# EAGLE design Tempy (EAGLE 7.1.0)
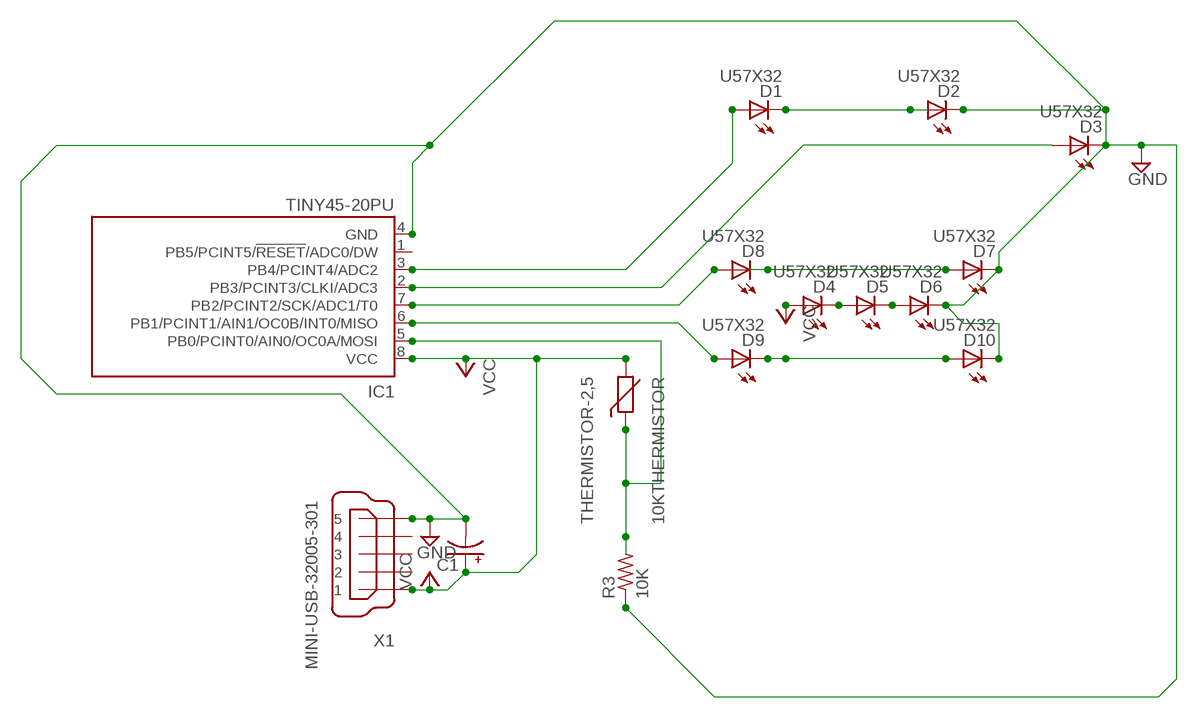
[diagram p0: schematic, sheet 1]

## Parts
10KTHERMISTOR  THERMISTOR-2,5  [RS-2,5]
C1  CPOL-USE5-4  [E5-4]
D1  U57X32  [U57X32]
D2  U57X32  [U57X32]
D3  U57X32  [U57X32]
D4  U57X32  [U57X32]
D5  U57X32  [U57X32]
D6  U57X32  [U57X32]
D7  U57X32  [U57X32]
D8  U57X32  [U57X32]
D9  U57X32  [U57X32]
D10  U57X32  [U57X32]
IC1  TINY45-20PU  TINY13-20PU  [DIL08]
R3  10K  R-US_0204/7  [0204/7]
X1  MINI-USB-32005-301  [32005-301]

## Nets
GND: C1.- D2.K(C) D3.K(C) D6.K(C) D7.K(C) D10.K(C) IC1.4(GND) R3.1 X1.5
N$1: D4.K(C) D5.A
N$2: D5.K(C) D6.A
N$3: D9.A IC1.6(PB1/PCINT1/AIN1/OC0B/INT0/MISO)
N$4: D1.K(C) D2.A
N$5: D8.A IC1.7(PB2/PCINT2/SCK/ADC1/T0)
N$6: D7.A D8.K(C)
N$7: D9.K(C) D10.A
N$8: D3.A IC1.2(PB3/PCINT3/CLKI/ADC3)
N$9: D1.A IC1.3(PB4/PCINT4/ADC2)
N$11: 10KTHERMISTOR.1 IC1.5(PB0/PCINT0/AIN0/OC0A/MOSI) R3.2
VCC: 10KTHERMISTOR.2 C1.+ D4.A IC1.8(VCC) X1.1
Unconnected: IC1.1(PB5/PCINT5/!RESET!/ADC0/DW) X1.2 X1.3 X1.4

## Library data of the parts
10KTHERMISTOR = varistor:THERMISTOR: THERMISTOR
C1 = rcl:CPOL-US: POLARIZED CAPACITOR, American symbol
D1-D10 = led:U57X32: LED rectangle, 5.7 x 3.2 mm
IC1 = atmel:TINY13: 8-bit AVR Microcontroller with 1K Bytes In-System Programmable Flash Source: http://www.atmel.com/dyn/resources/prod_documents/2535S.pdf; MPN: ATTINY13-20PU; OC_FARNELL: 9171550; OC_NEWARK: 96K6521
R3 = rcl:R-US_: RESISTOR, American symbol
X1 = con-cypressindustries:MINI-USB-: MINI USB-B Conector Source: www.cypressindustries.com; OC_FARNELL: unknown; OC_NEWARK: unknown

## Board
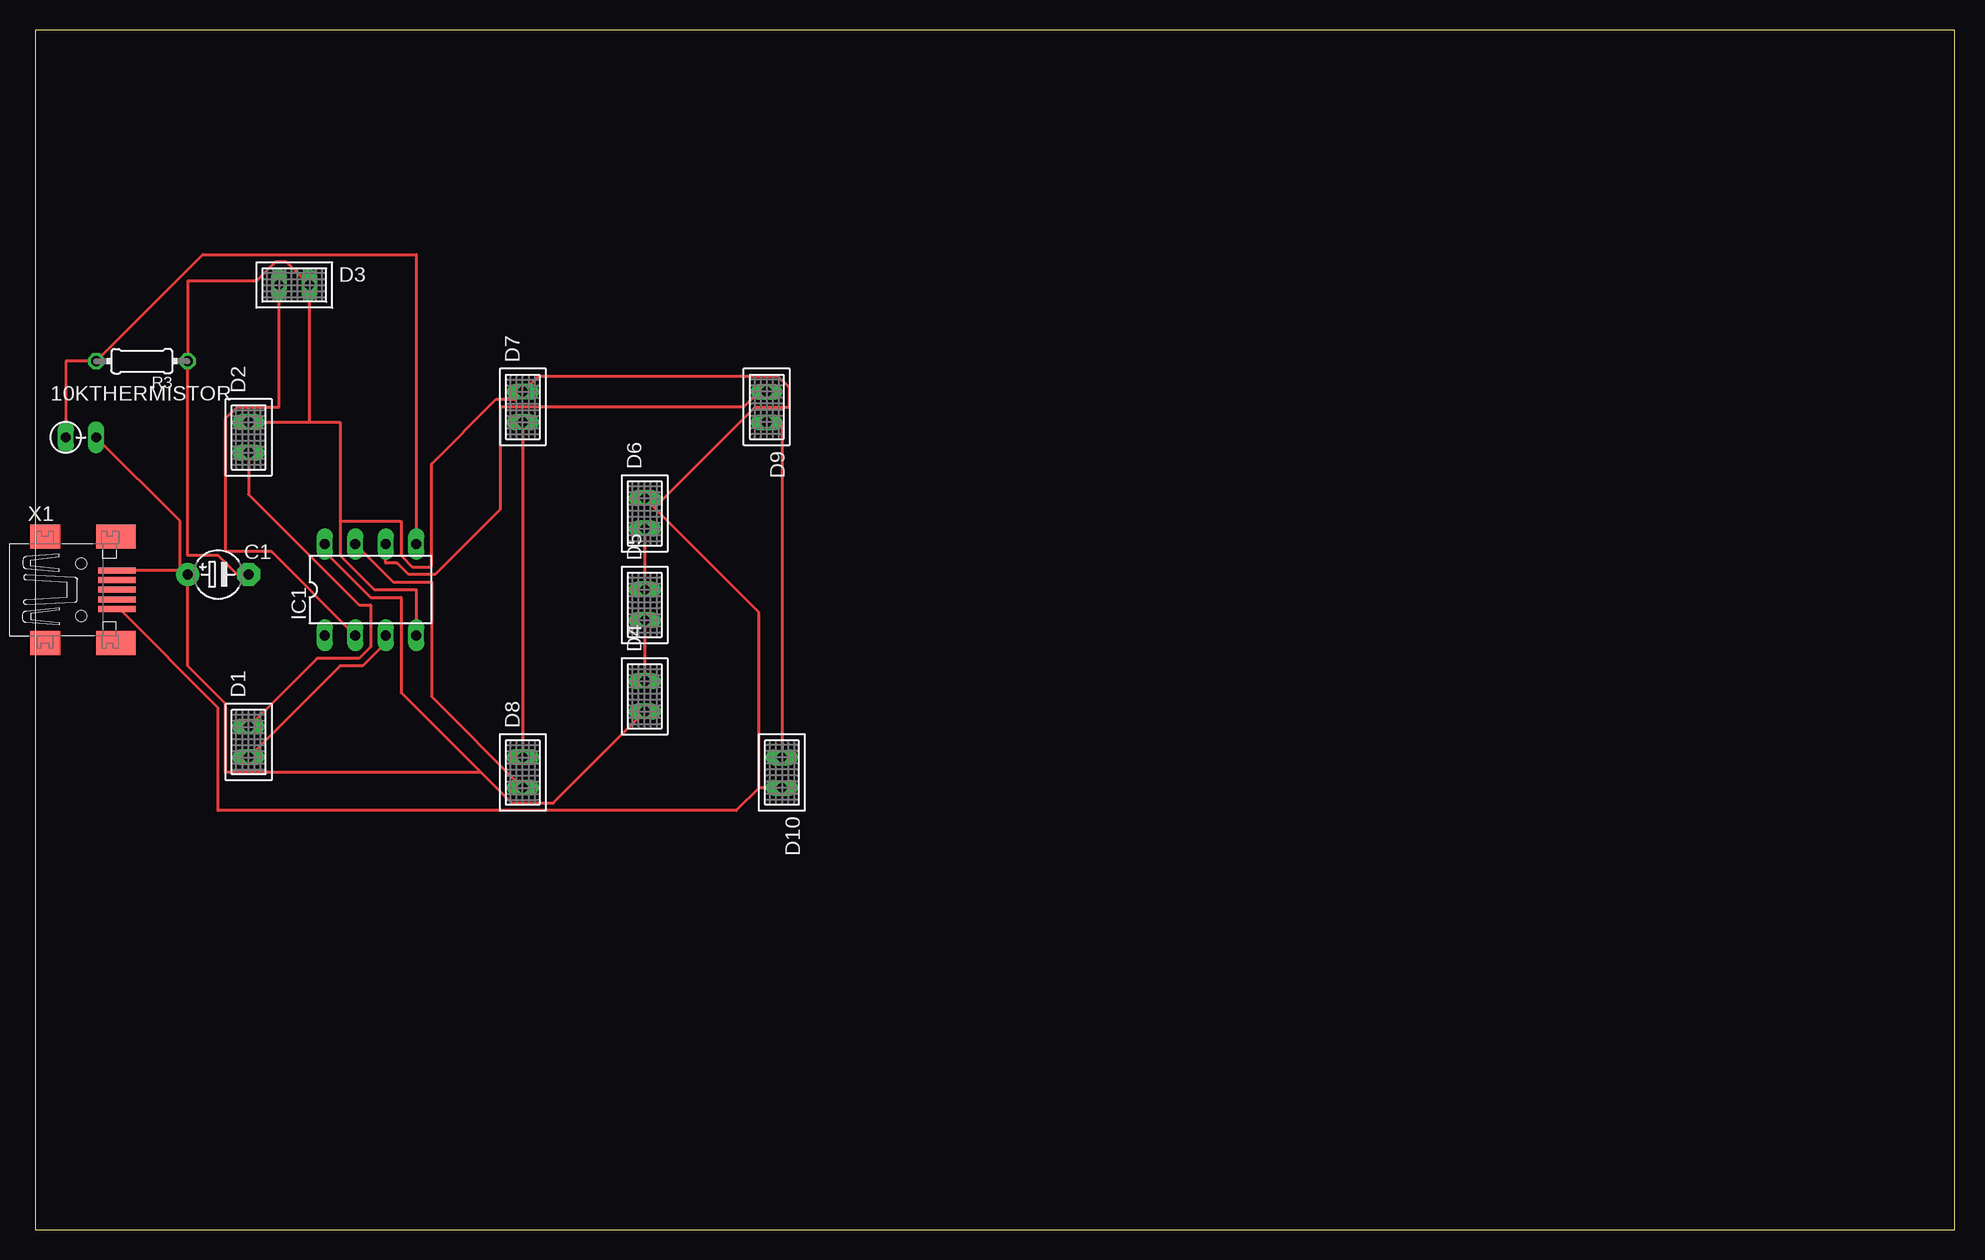
[diagram p1: board, top side]

Size 160 x 100 mm. Coordinates in mm from the lower left corner, seen from the top.
Outline: 0,0 160,0 160,100 0,100 0,0
Copper layers (1*16): Top 0.035mm / dielectric 1.5mm / Bottom 0.035mm
Design rules "default": minimum track width 10mil, minimum drill 24mil, track to track 8mil, track to pad 8mil, pad to pad 8mil, via to via 8mil, smd to smd 8mil, copper to edge 40mil, drill to drill 8mil, minimum pad ring 10mil, minimum via ring 8mil, stop-mask expansion 4mil, vias tented up to drill 0mil, thermal gap 10mil

### Footprints (pad centres in the part's own frame; a part is rotated, then mirrored left to right if it is on the bottom)
RS-2,5 = drill 0.813 long: 1 -1.27,0; 2 1.27,0
E5-4 = drill 0.813 pad 1.905: + -2.54,0 | drill 0.813 pad 1.905 octagon: - 2.54,0
U57X32 = drill 0.813 long: A -1.27,0; K 1.27,0
DIL08 = drill 0.813 long: 1 -3.81,-3.81; 2 -1.27,-3.81; 3 1.27,-3.81; 4 3.81,-3.81; 5 3.81,3.81; 6 1.27,3.81; 7 -1.27,3.81; 8 -3.81,3.81
0204/7 = drill 0.813 octagon: 1 -3.81,0; 2 3.81,0
32005-301 = smd 3.1 x 0.5: 1 3,1.6; 2 3,0.8; 3 3,0; 4 3,-0.8; 5 3,-1.6 | smd 2.5 x 2: M1 -3,-4.45; M2 -3,4.45 | smd 3.3 x 2: M3 2.9,4.45; M4 2.9,-4.45 | hole 0.9: 0,2.2; 0,-2.2

### Placement (x,y rotation side)
10KTHERMISTOR  3.81,66.04 0 top
C1  15.24,54.61 0 top
D1  17.78,40.64 90 top
D2  17.78,66.04 90 top
D3  21.59,78.74 0 top
D4  50.8,44.45 90 top
D5  50.8,52.07 90 top
D6  50.8,59.69 90 top
D7  40.64,68.58 90 top
D8  40.64,38.1 90 top
D9  60.96,68.58 270 top
D10  62.23,38.1 270 top
IC1  27.94,53.34 0 top
R3  8.89,72.39 180 top
X1  3.81,53.34 0 top

### Tracks (layer width: path | path; a pad name or v marks a point on that pad's centre or on a via)
GND
  Top 0.254: C1.- 16.83,54.61 15.24,56.2 12.7,56.2 R3.1 12.7,79.06 18.41,79.06 20,80.64 20.95,80.64 D3.K 22.86,67.31 | IC1.4 31.75,53.34 28.26,53.34 25.4,56.2 25.4,59.05 | 25.4,59.05 25.4,67.31 22.86,67.31 | D2.K 22.86,67.31 | 25.4,59.05 30.48,59.05 30.48,56.2 31.43,55.24 33.02,55.24 33.02,63.82 38.42,69.22 40.01,69.22 D7.K 41.91,71.12 61.91,71.12 62.87,70.17 62.87,68.58 60.01,68.58 51.75,60.33 51.44,60.33 | 51.44,60.33 60.33,51.44 60.33,36.83 | D10.K 60.33,36.83 | 60.33,36.83 58.42,34.92 15.24,34.92 15.24,43.5 6.99,51.75 X1.5 | 51.44,60.33 D6.K
N$1
  Top 0.254: D5.A D4.K
N$2
  Top 0.254: D6.A D5.K
N$3
  Top 0.254: IC1.6 29.21,55.56 30.16,55.56 31.11,54.61 33.34,54.61 38.73,60.01 38.73,68.58 59.05,68.58 60.33,69.85 D9.A
N$4
  Top 0.254: D1.K 23.5,47.62 26.99,47.62 27.94,48.58 27.94,52.07 26.99,52.07 17.78,61.28 D2.A
N$5
  Top 0.254: D8.A 33.02,44.45 33.02,53.98 29.84,53.98 IC1.7
N$6
  Top 0.254: D7.A D8.K
N$7
  Top 0.254: D10.A 62.23,67.31 D9.K
N$8
  Top 0.254: D3.A 20.32,68.58 16.83,68.58 15.88,67.63 15.88,56.52 19.68,56.52 IC1.2
N$9
  Top 0.254: D1.A 25.4,46.99 27.3,46.99 29.21,48.9 IC1.3
N$11
  Top 0.254: 10KTHERMISTOR.1 2.54,72.39 R3.2 13.97,81.28 31.75,81.28 IC1.5
VCC
  Top 0.254: 10KTHERMISTOR.2 12.06,59.05 12.06,54.93 | 12.06,54.93 12.06,54.61 C1.+ | 12.06,54.93 6.99,54.93 X1.1 | 12.06,54.93 C1.+ | D4.A 43.18,35.56 39.69,35.56 37.15,38.1 | 37.15,38.1 30.48,44.77 30.48,52.7 27.94,52.7 24.13,56.52 IC1.8 | C1.+ 12.7,46.99 15.88,43.81 15.88,38.1 37.15,38.1